# EAGLE design Joystick (EAGLE 6.1)
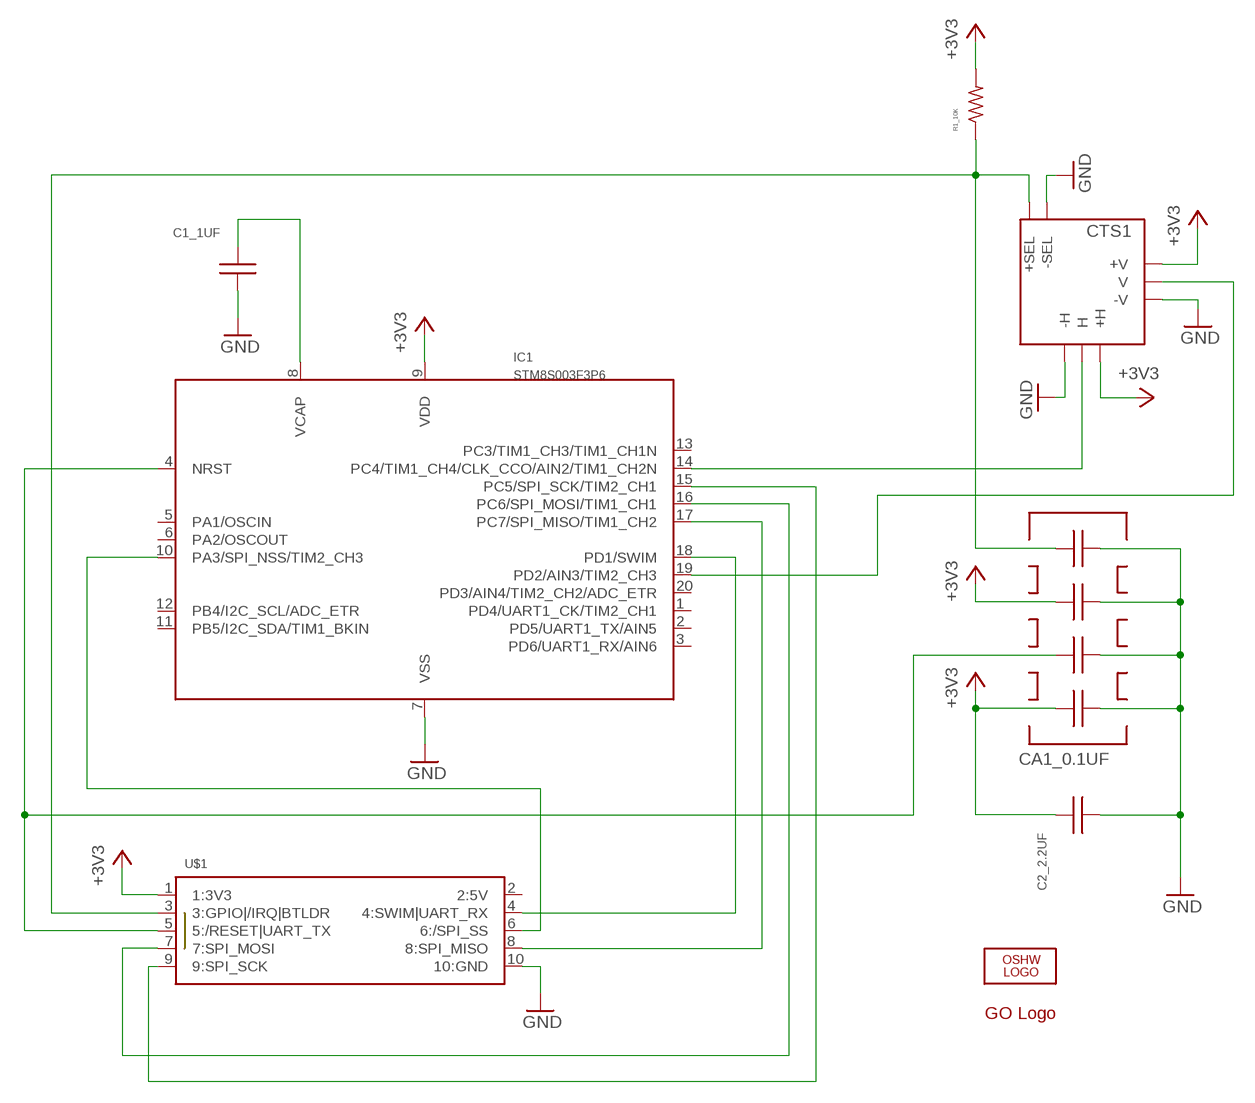
[diagram p0: schematic, sheet 1]

## Parts
C1_1UF  MURATA_GRM_1UF_CER_CAP_0805  [0805]
C2_2.2UF  CAP_CER_2.2UF_0805  [0805]
CA1_0.1UF  TAYIO-YUDEN_0.1UF_CAP_ARRAY_0805  [TAYIO-YUDEN_CAP_ARRAY_4_CIRCUITS_0805]
CTS1  CTS252B103A60NB10K  [JOYSTICK+SWITCH]
IC1  STM8S003F3P6  [STM8S003F3P6]
LOGO1  OSHW_LOGO_8MILX0150-NT  [OSHW_8X150_NOTEXT]
R1_10K  RESISTOR_0805  [0805]
U$1  GO_CONNECTOR  [FCI-1.27X1.27MM_10PIN_HEADER_SHROUDED_SMT]
U$5  GO_LOGO  [GO_LOGO]

## Nets
+3V3: C2_2.2UF.A CA1_0.1UF.4 CA1_0.1UF.8 CTS1.H+(+H) CTS1.V+(+V) IC1.9(VDD) R1_10K.K U$1.1(1:3V3)
GND: C1_1UF.K C2_2.2UF.K CA1_0.1UF.1 CA1_0.1UF.3 CA1_0.1UF.5 CA1_0.1UF.7 CTS1.H-(-H) CTS1.SEL-(-SEL) CTS1.V-(-V) IC1.7(VSS) U$1.10(10:GND)
GOBUS_GPIO: CA1_0.1UF.6 CTS1.SEL+(+SEL) R1_10K.A U$1.3(3:GPIO|/IRQ|BTLDR)
N$2: IC1.10(PA3/SPI_NSS/TIM2_CH3) U$1.6(6:/SPI_SS)
N$3: CA1_0.1UF.2 IC1.4(NRST) U$1.5(5:/RESET|UART_TX)
N$4: IC1.18(PD1/SWIM) U$1.4(4:SWIM|UART_RX)
N$5: IC1.17(PC7/SPI_MISO/TIM1_CH2) U$1.8(8:SPI_MISO)
N$6: IC1.16(PC6/SPI_MOSI/TIM1_CH1) U$1.7(7:SPI_MOSI)
N$7: IC1.15(PC5/SPI_SCK/TIM2_CH1) U$1.9(9:SPI_SCK)
N$8: C1_1UF.A IC1.8(VCAP)
N$9: CTS1.H-OUT(H) IC1.14(PC4/TIM1_CH4/CLK_CCO/AIN2/TIM1_CH2N)
N$10: CTS1.V-OUT(V) IC1.19(PD2/AIN3/TIM2_CH3)
Unconnected: IC1.1(PD4/UART1_CK/TIM2_CH1) IC1.2(PD5/UART1_TX/AIN5) IC1.3(PD6/UART1_RX/AIN6) IC1.5(PA1/OSCIN) IC1.6(PA2/OSCOUT) IC1.11(PB5/I2C_SDA/TIM1_BKIN) IC1.12(PB4/I2C_SCL/ADC_ETR) IC1.13(PC3/TIM1_CH3/TIM1_CH1N) IC1.20(PD3/AIN4/TIM2_CH2/ADC_ETR)

## Power pins joined to a net without a drawn wire
2:5V: U$1.2(2:5V)

## Library data of the parts
C1_1UF = Nwazet.Go:MURATA_GRM_1UF_CER_CAP_0805
C2_2.2UF = Nwazet.Go:CAP_CER_2.2UF_0805
CA1_0.1UF = Nwazet.Go:TAYIO-YUDEN_0.1UF_CAP_ARRAY_0805
CTS1 = Nwazet.Go:CTS252B103A60NB: CTS Series 252 Mini Joystick Two Axis, Mini-joystick With Momentary Switch
IC1 = Nwazet.Go:STM8S003F3P6: IC MCU 8BIT 8KB FLASH 20TSSOP
LOGO1 = ohw-logo:OSHW_LOGO_8MIL
R1_10K = Nwazet.Go:RESISTOR_0805
U$1 = Nwazet.Go:GO_CONNECTOR
U$5 = Nwazet.Go:GO_LOGO

## Board
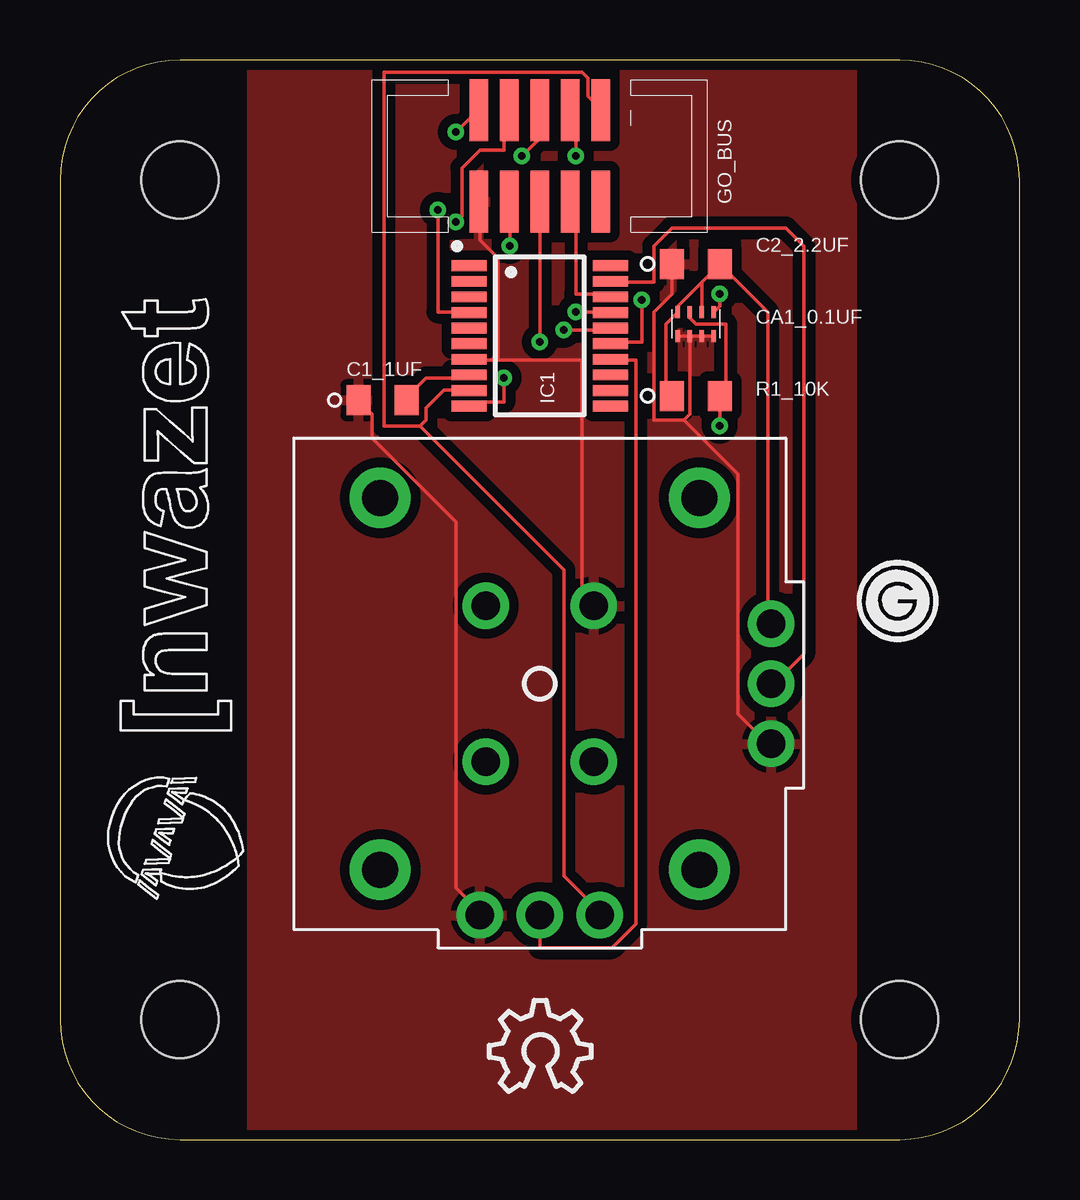
[diagram p1: board, top side]
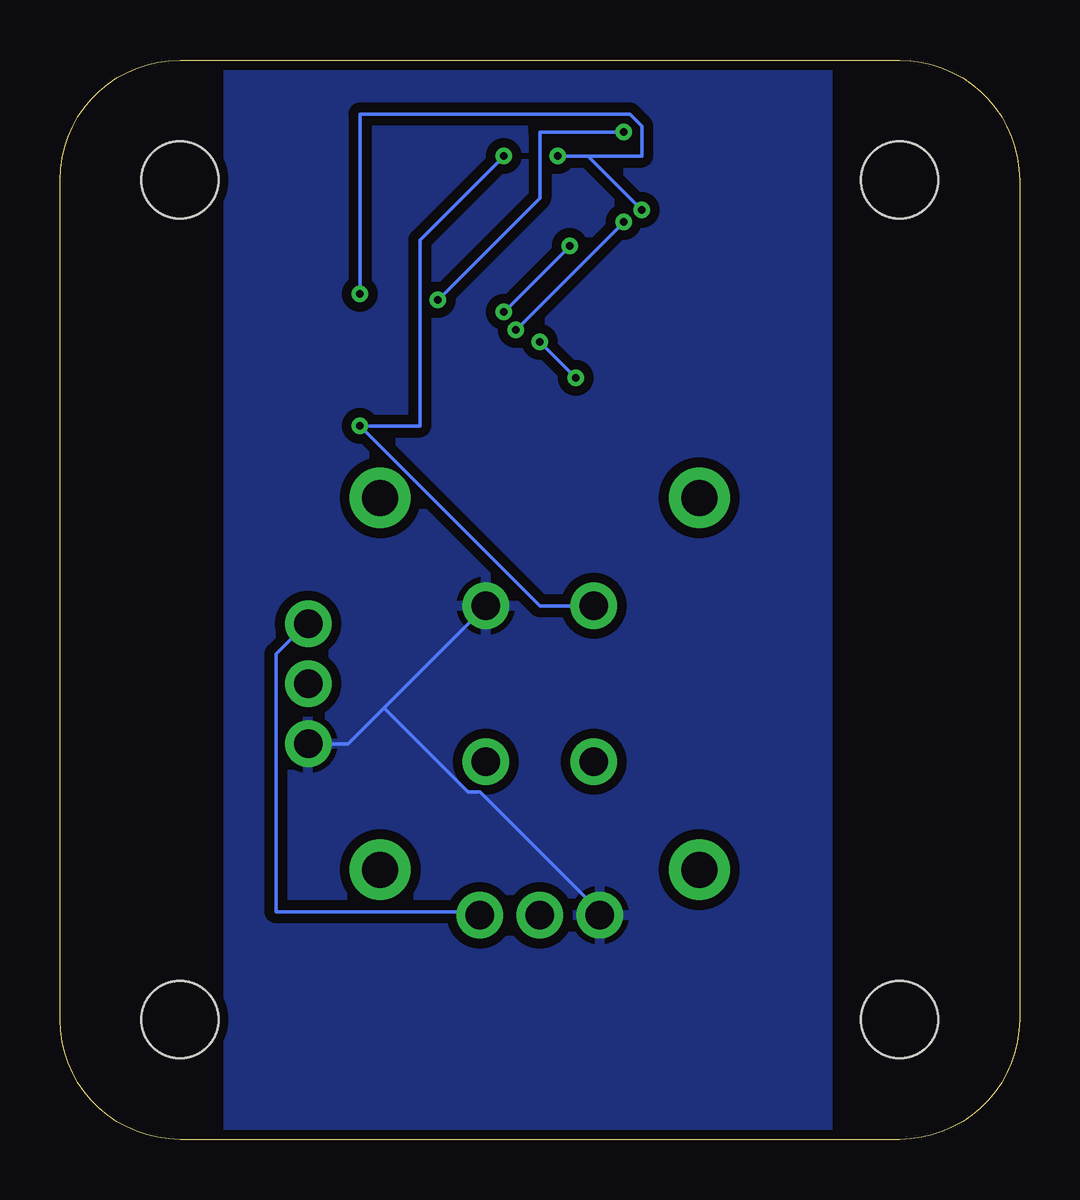
[diagram p2: board, bottom side, seen from below]

Size 40 x 45 mm. Coordinates in mm from the lower left corner, seen from the top.
Outline: 0,40 0,5 arc90 5,0 35,0 arc90 40,5 40,40 arc90 35,45 5,45 arc90 0,40
Copper layers (1*16): Top 0.0356mm / dielectric 1.5011mm / Bottom 0.0356mm
Design rules: minimum track width 6mil, minimum drill 13mil, track to track 6mil, track to pad 6mil, pad to pad 6mil, via to via 6mil, smd to smd 6mil, copper to edge 15mil, drill to drill 6mil, minimum pad ring 7mil, minimum via ring 7mil, stop-mask expansion 4mil, vias tented up to drill 0mil, thermal gap 10mil
Holes 3.2 mm at 5,5 35,5 35,40 5,40

### Footprints (pad centres in the part's own frame; a part is rotated, then mirrored left to right if it is on the bottom)
0805 = smd 1.25 x 1: A 0,1; K 0,-1
TAYIO-YUDEN_CAP_ARRAY_4_CIRCUITS_0805 = smd 0.2 x 0.5: 1 -0.75,0.5; 2 -0.75,-0.5; 3 -0.25,0.5; 4 -0.25,-0.5; 5 0.25,0.5; 6 0.25,-0.5; 7 0.75,0.5; 8 0.75,-0.5
JOYSTICK+SWITCH = drill 1.2 pad 1.93: B 2.25,-3.25; D -2.25,-3.25; H+ 2.5,-9.65; H- -2.5,-9.65; H-OUT 0,-9.65; SEL+ -2.25,3.25; SEL- 2.25,3.25; V+ 9.65,2.5; V- 9.65,-2.5; V-OUT 9.65,0 | drill 1.5 pad 2.54: MOUNT1 -6.65,7.75; MOUNT2 -6.65,-7.75; MOUNT3 6.65,-7.75; MOUNT4 6.65,7.75
STM8S003F3P6 = smd 1.45 x 0.45: 1 -2.95,2.925; 2 -2.95,2.275; 3 -2.95,1.625; 4 -2.95,0.975; 5 -2.95,0.325; 6 -2.95,-0.325; 7 -2.95,-0.975; 8 -2.95,-1.625; 9 -2.95,-2.275; 10 -2.95,-2.925; 11 2.95,-2.925; 12 2.95,-2.275; 13 2.95,-1.625; 14 2.95,-0.975; 15 2.95,-0.325; 16 2.95,0.325; 17 2.95,0.975; 18 2.95,1.625; 19 2.95,2.275; 20 2.95,2.925
FCI-1.27X1.27MM_10PIN_HEADER_SHROUDED_SMT = smd 0.76 x 2.6: 1 -2.54,-1.905; 2 -2.54,1.905; 3 -1.27,-1.905; 4 -1.27,1.905; 5 0,-1.905; 6 0,1.905; 7 1.27,-1.905; 8 1.27,1.905; 9 2.54,-1.905; 10 2.54,1.905

### Placement (x,y rotation side)
C1_1UF  13.44,30.82 270 top
C2_2.2UF  26.5,36.5 270 top
CA1_0.1UF  26.5,34 180 top
CTS1  20,19 0 top
IC1  20,33.5 0 top
LOGO1  17.9,2 0 top
R1_10K  26.5,31 270 top
U$1  20,41 180 top
U$5  35,22.3 0 top

### Tracks (layer width: path | path; a pad name or v marks a point on that pad's centre or on a via)
+3V3
  Top 0.152: 26.75,35.75 25.75,34.75 CA1_0.1UF.8 25.25,34 25.25,31.25 R1_10K.K | 26.75,35.75 CA1_0.1UF.4 | IC1.9 17,31.25 16,31.25 15.25,30.5 15.25,30 15,29.75 | U$1.1 22.5,43 22,43.5 22,44.25 21.75,44.5 13.5,44.5 13.5,30.25 13.5,29.75 15,29.75 | 26.75,35.75 C2_2.2UF.A 29.5,34.5 29.5,21.5 CTS1.V+ | 15,29.75 21,23.75 21,11 22.5,9.5 CTS1.H+
  Bottom 0.152: CTS1.V+ 29.75,21.5 31,20.25 31,9.5 22.5,9.5 CTS1.H+
GND
  Top 0.152: 12.5,30.75 C1_1UF.K 12.5,30.75 | 18.25,32.5 17.25,32.5 IC1.7 | 18.25,32.5 18.25,36.75 17.5,37.5 17.5,39 U$1.10 | CA1_0.1UF.5 CA1_0.1UF.7 | CA1_0.1UF.5 CA1_0.1UF.3 CA1_0.1UF.1 | 18.25,32.5 21.75,32.5 21.75,22.75 CTS1.SEL- | 12.5,30.75 13,30.25 13,29.25 16.5,25.75 16.5,10.5 17.5,9.5 CTS1.H- | CA1_0.1UF.5 26.25,30.25 26,30 | 26,30 24.75,30 24.75,34.5 25.5,35.25 C2_2.2UF.K | 26,30 28.25,27.75 28.25,17.75 29.5,16.5 CTS1.V-
  Bottom 0.152: 26.5,18 28,16.5 29.5,16.5 CTS1.V- | 26.5,18 CTS1.SEL- | 26.5,18 23,14.5 22.5,14.5 17.5,9.5 CTS1.H-
  pour Bottom (isolate 0.406): 8,45 33,45 33,0 8,0
  pour Top (isolate 0.406): 8,45 33,45 33,0 8,0
GOBUS_GPIO  (via drill 0.33)
  Top 0.152: CA1_0.1UF.6 26.25,34.25 26.5,34 27.75,34 27.75,31.25 R1_10K.A v27.5,29.75 | v21.5,41 21.5,42.75 U$1.3
  Bottom 0.152: v21.5,41 25,37.5 25,29.75 v27.5,29.75 20,22.25 CTS1.SEL+
N$2  (via drill 0.33)
  Top 0.152: v18.5,31.75 18.5,30.75 17.25,30.75 IC1.10 | v20,33.25 20,39 U$1.6
  Bottom 0.152: v20,33.25 v18.5,31.75
N$3  (via drill 0.33)
  Top 0.152: v15.75,38.75 15.75,34.5 17,34.5 IC1.4 | v19.25,41 20,41.75 20,42.75 U$1.5 | CA1_0.1UF.2 27.5,34.75 v27.5,35.25
  Bottom 0.152: 18,41 v15.75,38.75 | v19.25,41 18,41 | v27.5,35.25 27.5,42.75 16.25,42.75 15.75,42.25 15.75,41 18,41
N$4
  Top 0.152: IC1.18 22.75,35.25 21.5,35.25 21.5,39 U$1.4
N$5  (via drill 0.33)
  Top 0.152: v21.5,34.5 22.75,34.5 IC1.17 | v18.75,37.25 18.75,39 U$1.8
  Bottom 0.152: v18.75,37.25 v21.5,34.5
N$6  (via drill 0.33)
  Top 0.152: v21,33.75 22.75,33.75 IC1.16 | v16.5,38.25 16.75,38.5 16.75,40.5 17.5,41.25 18.5,41.25 18.5,42.75 U$1.7
  Bottom 0.152: v16.5,38.25 v21,33.75
N$7  (via drill 0.33)
  Top 0.152: v24.25,35 24.25,33.25 23,33.25 IC1.15 | v16.5,42 17.25,42.75 U$1.9
  Bottom 0.152: v24.25,35 20,39.25 20,42 v16.5,42
N$8
  Top 0.152: C1_1UF.A 14.5,31 15.25,31.75 17,31.75 IC1.8
N$9
  Top 0.152: IC1.14 23,32.5 24,32.5 24,9 23,8 20,8 20,9.25 CTS1.H-OUT
N$10
  Top 0.152: IC1.19 23,35.75 24.75,35.75 24.75,37.25 25.5,38 30.25,38 31,37.25 31,20.25 29.75,19 CTS1.V-OUT

### Text on the board
tPlace: GO_BUS | IC1